# Altium schematic sheet MK32_2.SchDoc
size 420 x 297 mm
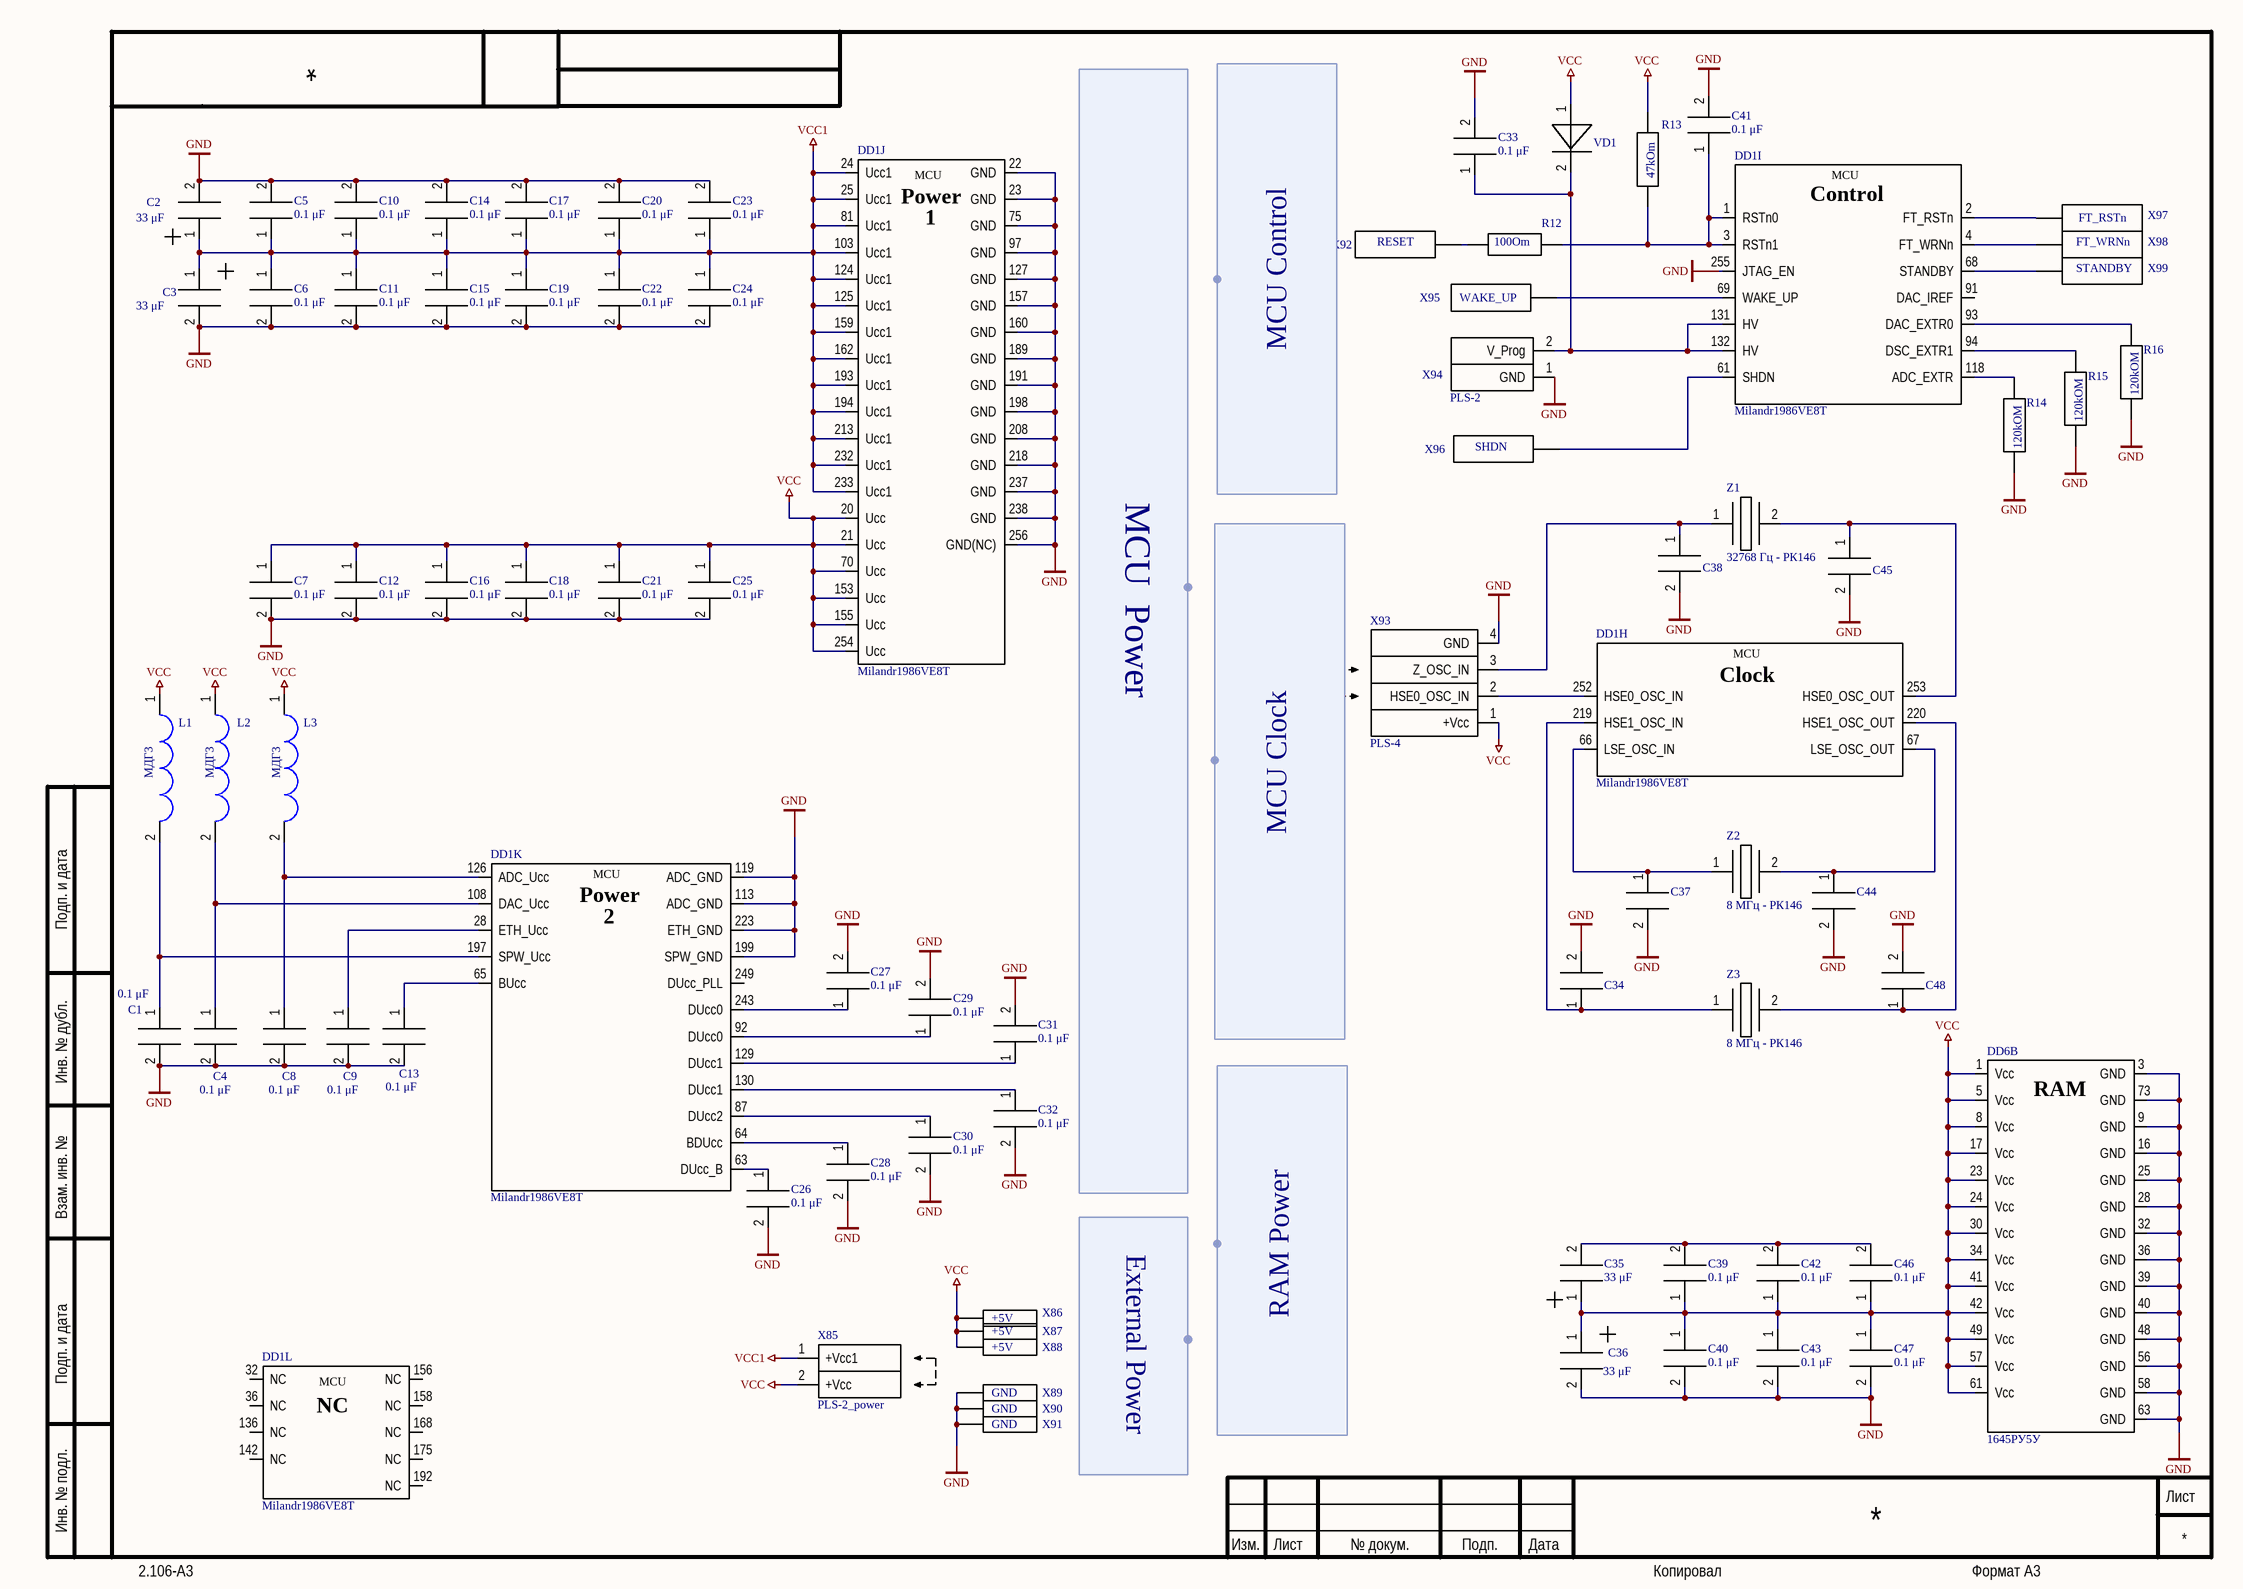
[diagram p0: MK32_2.SchDoc]

## Parts
(Parts that share a designator on the sheet are numbered #1, #2 ... from top to bottom, then left to right.)
C1  0.1 μF  [C 0603]
C2  33 μF
C3  33 μF
C4  0.1 μF  [C 0603]
C5  0.1 μF  [C 0603]
C6  0.1 μF  [C 0603]
C7  0.1 μF  [C 0603]
C8  0.1 μF  [C 0603]
C9  0.1 μF  [C 0603]
C10  0.1 μF  [C 0603]
C11  0.1 μF  [C 0603]
C12  0.1 μF  [C 0603]
C13  0.1 μF  [C 0603]
C14  0.1 μF  [C 0603]
C15  0.1 μF  [C 0603]
C16  0.1 μF  [C 0603]
C17  0.1 μF  [C 0603]
C18  0.1 μF  [C 0603]
C19  0.1 μF  [C 0603]
C20  0.1 μF  [C 0603]
C21  0.1 μF  [C 0603]
C22  0.1 μF  [C 0603]
C23  0.1 μF  [C 0603]
C24  0.1 μF  [C 0603]
C25  0.1 μF  [C 0603]
C26  0.1 μF  [C 0603]
C27  0.1 μF  [C 0603]
C28  0.1 μF  [C 0603]
C29  0.1 μF  [C 0603]
C30  0.1 μF  [C 0603]
C31  0.1 μF  [C 0603]
C32  0.1 μF  [C 0603]
C33  0.1 μF  [C 0603]
C34  C 0603  [C 0603]  (value not drawn)
C35  33 μF
C36  33 μF
C37  C 0603  [C 0603]  (value not drawn)
C38  C 0603  [C 0603]  (value not drawn)
C39  0.1 μF  [C 0603]
C40  0.1 μF  [C 0603]
C41  0.1 μF  [C 0603]
C42  0.1 μF  [C 0603]
C43  0.1 μF  [C 0603]
C44  C 0603  [C 0603]  (value not drawn)
C45  C 0603  [C 0603]  (value not drawn)
C46  0.1 μF  [C 0603]
C47  0.1 μF  [C 0603]
C48  C 0603  [C 0603]  (value not drawn)
DD1#1  Milandr1986VE8T  [4244.256-3]  (part J of 10)
DD1#2  Milandr1986VE8T  [4244.256-3]  (part I of 9)
DD1#3  Milandr1986VE8T  [4244.256-3]  (part H of 8)
DD1#4  Milandr1986VE8T  [4244.256-3]  (part K of 11)
DD1#5  Milandr1986VE8T  [4244.256-3]  (part L of 12)
DD6  1645РУ5У  [5134.64-6]  (part B of 2)
L1  МДГ3  [МДГ3]
L2  МДГ3  [МДГ3]
L3  МДГ3  [МДГ3]
R12  100Om  [C 0603]
R13  47kOm  [C 0603]
R14  120kOM  [C 0603]
R15  120kOM  [C 0603]
R16  120kOM  [C 0603]
VD1  2Д510А  [2Д510А]  (value not drawn)
X85  PLS-2_power  [pls2]
X86  +5V  [PL]
X87  +5V  [PL]
X88  +5V  [PL]
X89  GND  [PL]
X90  GND  [PL]
X91  GND  [PL]
X92  RESET  [PL]
X93  PLS-4  [pls4]
X94  PLS-2  [pls2]
X95  WAKE_UP  [PL]
X96  SHDN  [PL]
X97  FT_RSTn  [PL]
X98  FT_WRNn  [PL]
X99  STANDBY  [PL]
Z1  32768 Гц - РК146  [РК146]
Z2  8 МГц - РК146  [РК146]
Z3  8 МГц - РК146  [РК146]

## Harnesses
MCU  Power: 
MCU Control: 
MCU Clock: 
RAM Power: 
External Power: 

## Nets
GND: C1.2 C2.2 C3.2 C4.2 C5.2 C6.2 C7.2 C8.2 C9.2 C10.2 C11.2 C12.2 C13.2 C14.2 C15.2 C16.2 C17.2 C18.2 C19.2 C20.2 C21.2 C22.2 C23.2 C24.2 C25.2 C26.2 C27.2 C28.2 C29.2 C30.2 C31.2 C32.2 C33.2 C34.2 C36.2 C37.2 C38.2 C40.2 C41.2 C43.2 C44.2 C45.2 C47.2 C48.2 DD1#1.22(GND) DD1#1.23(GND) DD1#1.75(GND) DD1#1.97(GND) DD1#1.127(GND) DD1#1.157(GND) DD1#1.160(GND) DD1#1.189(GND) DD1#1.191(GND) DD1#1.198(GND) DD1#1.208(GND) DD1#1.218(GND) DD1#1.237(GND) DD1#1.238(GND) DD1#1.256(GND(NC)) DD1#2.255(JTAG_EN) DD1#4.113(ADC_GND) DD1#4.119(ADC_GND) DD1#4.199(SPW_GND) DD1#4.223(ETH_GND) DD6.3(GND) DD6.9(GND) DD6.16(GND) DD6.25(GND) DD6.28(GND) DD6.32(GND) DD6.36(GND) DD6.39(GND) DD6.40(GND) DD6.48(GND) DD6.56(GND) DD6.58(GND) DD6.63(GND) DD6.73(GND) R14.2 R15.2 R16.2 X89.?1(name) X90.?1(name) X91.?1(name) X93.4(GND) X94.1(GND)
VCC: C7.1 C12.1 C16.1 C18.1 C21.1 C25.1 C35.1 C36.1 C39.1 C40.1 C42.1 C43.1 C46.1 C47.1 DD1#1.20(Ucc) DD1#1.21(Ucc) DD1#1.70(Ucc) DD1#1.153(Ucc) DD1#1.155(Ucc) DD1#1.254(Ucc) DD6.1(Vcc) DD6.5(Vcc) DD6.8(Vcc) DD6.17(Vcc) DD6.23(Vcc) DD6.24(Vcc) DD6.30(Vcc) DD6.34(Vcc) DD6.41(Vcc) DD6.42(Vcc) DD6.49(Vcc) DD6.57(Vcc) DD6.61(Vcc) L1.1 L2.1 L3.1 R13.2 VD1.1 X85.2(+Vcc) X86.?1(name) X87.?1(name) X88.?1(name) X93.1(+Vcc)
VCC1: C2.1 C3.1 C5.1 C6.1 C10.1 C11.1 C14.1 C15.1 C17.1 C19.1 C20.1 C22.1 C23.1 C24.1 DD1#1.24(Ucc1) DD1#1.25(Ucc1) DD1#1.81(Ucc1) DD1#1.103(Ucc1) DD1#1.124(Ucc1) DD1#1.125(Ucc1) DD1#1.159(Ucc1) DD1#1.162(Ucc1) DD1#1.193(Ucc1) DD1#1.194(Ucc1) DD1#1.213(Ucc1) DD1#1.232(Ucc1) DD1#1.233(Ucc1) X85.1(+Vcc1)
NetC1_1: C1.1 DD1#4.197(SPW_Ucc) L1.2
NetC4_1: C4.1 DD1#4.108(DAC_Ucc) L2.2
NetC8_1: C8.1 DD1#4.126(ADC_Ucc) L3.2
NetC9_1: C9.1 DD1#4.28(ETH_Ucc)
NetC13_1: C13.1 DD1#4.65(BUcc)
NetC26_1: C26.1 DD1#4.63(DUcc_B)
NetC27_1: C27.1 DD1#4.243(DUcc0)
NetC28_1: C28.1 DD1#4.64(BDUcc)
NetC29_1: C29.1 DD1#4.92(DUcc0)
NetC30_1: C30.1 DD1#4.87(DUcc2)
NetC31_1: C31.1 DD1#4.129(DUcc1)
NetC32_1: C32.1 DD1#4.130(DUcc1)
NetC33_1: C33.1 DD1#2.131(HV) DD1#2.132(HV) VD1.2 X94.2(V_Prog)
NetC34_1: C34.1 DD1#3.219(HSE1_OSC_IN) Z3.1
NetC35_2: C35.2 C39.2 C42.2 C46.2
NetC37_1: C37.1 DD1#3.66(LSE_OSC_IN) Z2.1
NetC38_1: C38.1 X93.3(Z_OSC_IN) Z1.1
NetC41_1: C41.1 DD1#2.1(RSTn0) DD1#2.3(RSTn1) R12.2 R13.1
NetC44_1: C44.1 DD1#3.67(LSE_OSC_OUT) Z2.2
NetC45_1: C45.1 DD1#3.253(HSE0_OSC_OUT) Z1.2
NetC48_1: C48.1 DD1#3.220(HSE1_OSC_OUT) Z3.2
NetDD1#2_2: DD1#2.2(FT_RSTn) X97.?1(name)
NetDD1#2_4: DD1#2.4(FT_WRNn) X98.?1(name)
NetDD1#2_61: DD1#2.61(SHDN) X96.?1(name)
NetDD1#2_68: DD1#2.68(STANDBY) X99.?1(name)
NetDD1#2_69: DD1#2.69(WAKE_UP) X95.?1(name)
NetDD1#2_93: DD1#2.93(DAC_EXTR0) R16.1
NetDD1#2_94: DD1#2.94(DSC_EXTR1) R15.1
NetDD1#2_118: DD1#2.118(ADC_EXTR) R14.1
NetDD1#3_252: DD1#3.252(HSE0_OSC_IN) X93.2(HSE0_OSC_IN)
NetR12_1: R12.1 X92.?1(name)

Not connected (* = marked no-connect by the designer): DD1#2 91(DAC_IREF); DD1#4 249(DUcc_PLL); DD1#5 32(NC) 36(NC) 136(NC) 142(NC) 156(NC) 158(NC) 168(NC) 175(NC) 192(NC)

## Notes on the sheet
- Подп. и дата
- Инв. № дубл.
- Взам. инв. №
- Инв. № подл.
- Изм.
- Лист
- № докум.
- Подп.
- Дата
- 2.106-A3
- Копировал
- Формат А3
- (in symbol 1645РУ5У, part B) RAM
- (in symbol Milandr1986VE8T, part H) MCU; Clock
- (in symbol Milandr1986VE8T, part I) MCU; Control
- (in symbol Milandr1986VE8T, part J) MCU; Power
- (in symbol Milandr1986VE8T, part K) MCU; Power
- (in symbol Milandr1986VE8T, part L) MCU

## Library data of the parts
C1 C4-C33 C39-C43 C46 C47 = C 0603
C2 C3 C35 C36 = C К53-68С(тантал С)
R12-R16 = R0603
X86-X92 X95-X99 = PL
Z1-Z3 = РК146
DD1#1-DD1#5 = Milandr1986VE8T: Parameter 1: *